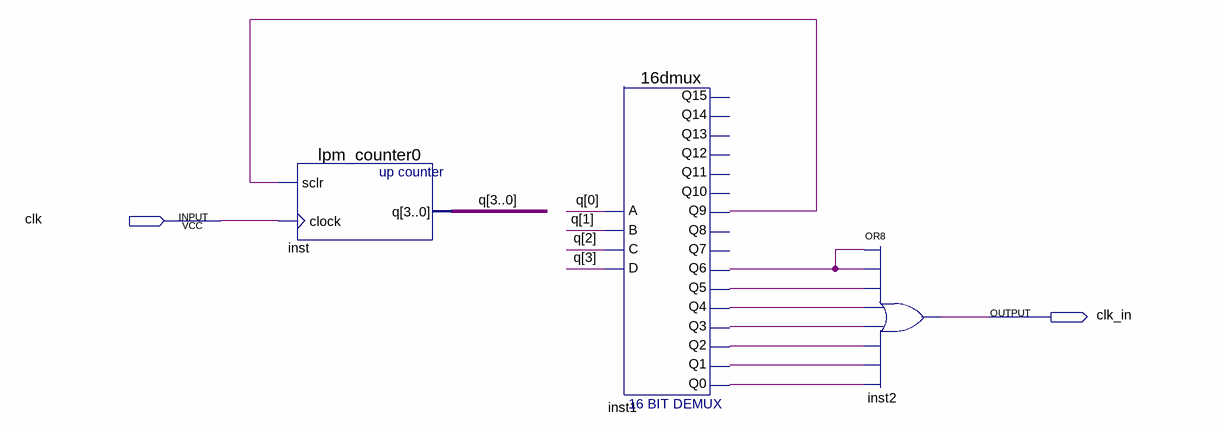
[diagram p0: schematic sheet]
// Quartus schematic lab2_block1.bdf as structural Verilog: 3 symbols, 2 pins
module lab2_block1 (
  input  clk,
  output clk_in
);

  wire inst1_q0, inst1_q1, inst1_q2, inst1_q3, inst1_q4, inst1_q5, inst1_q6, inst1_q9;
  wire [3:0] q;

  lpm_counter0 inst (.sclr(inst1_q9), .clock(clk), .q(q));
  \16dmux  inst1 (
    .C(q[2]), .B(q[1]), .A(q[0]), .D(q[3]), .Q9(inst1_q9), .Q4(inst1_q4), .Q5(inst1_q5), .Q6(inst1_q6),
    .Q2(inst1_q2), .Q3(inst1_q3), .Q0(inst1_q0), .Q1(inst1_q1));  // open: Q12, Q13, Q11, Q10, Q7, Q8, Q14, Q15
  or inst2 (clk_in, inst1_q6, inst1_q6, inst1_q5, inst1_q4, inst1_q3, inst1_q2, inst1_q1, inst1_q0);
endmodule
